# EAGLE design loramesh (EAGLE 9.6.2)
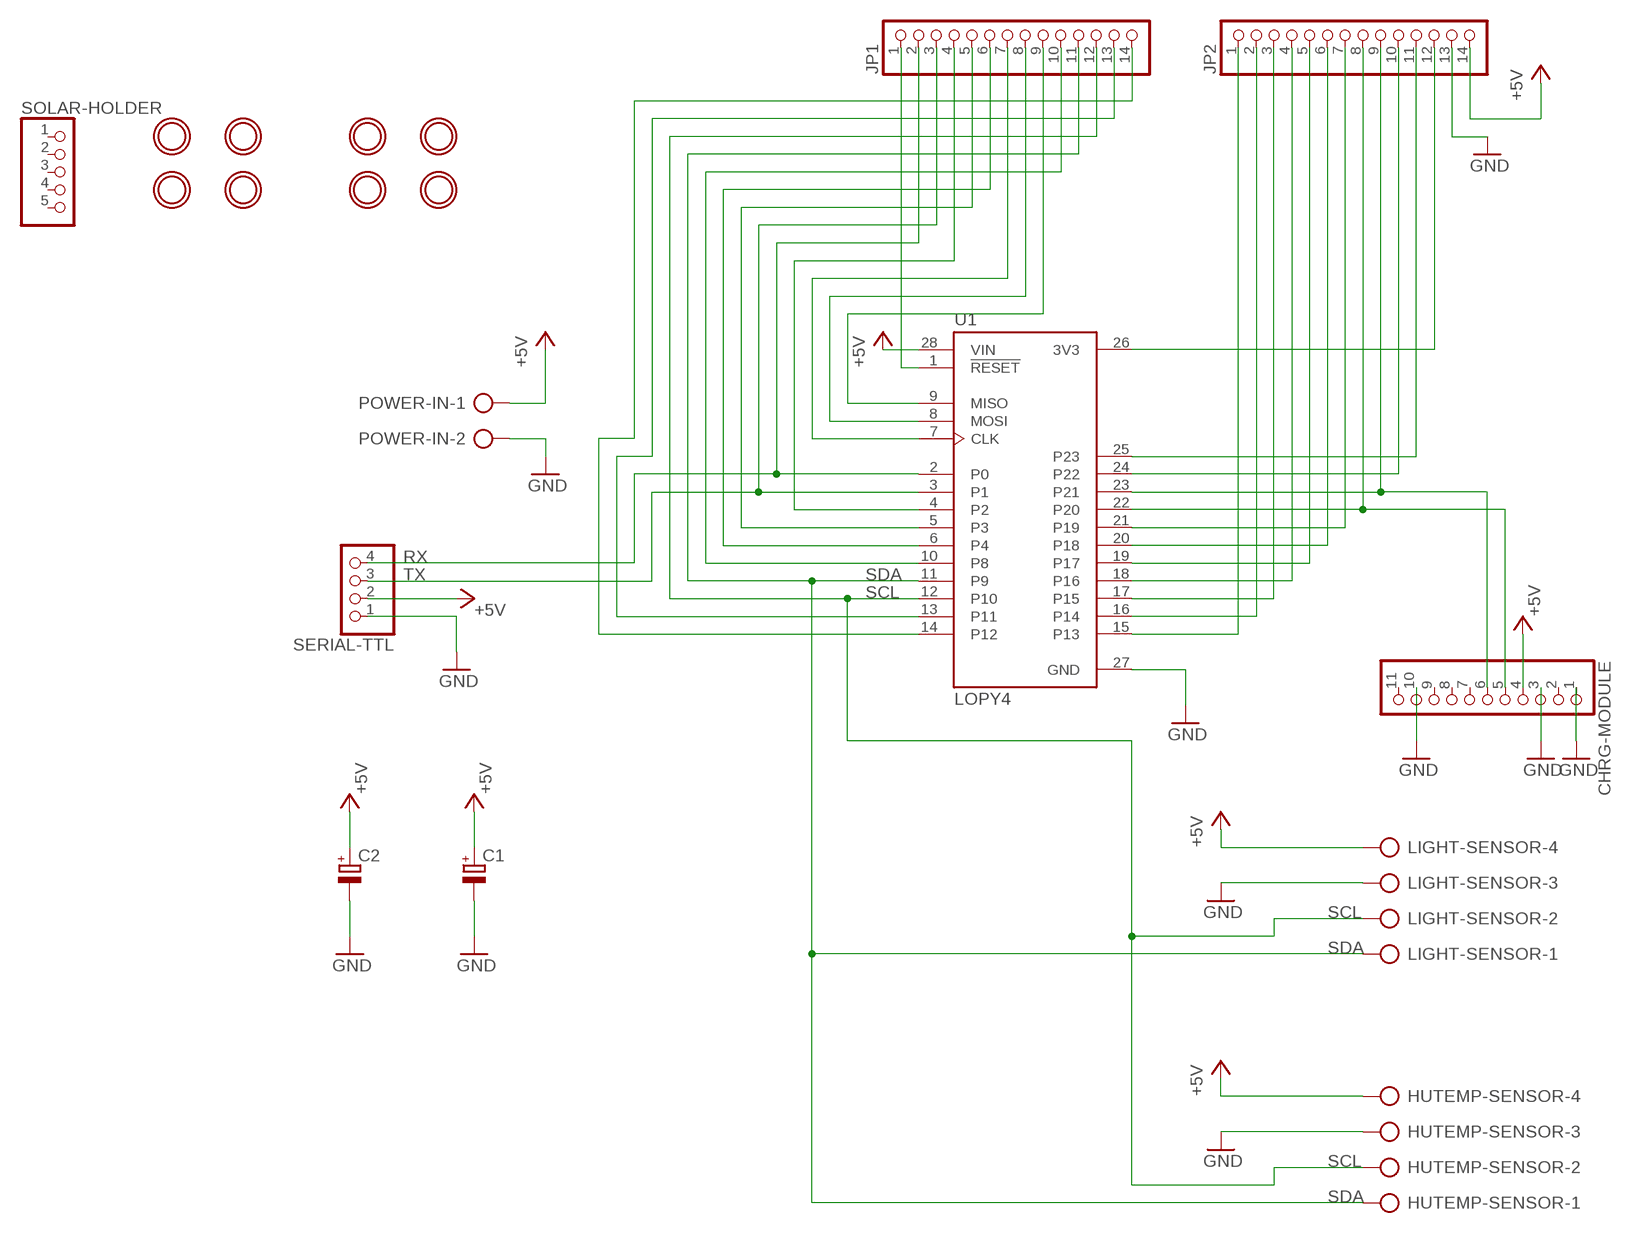
[diagram p0: schematic, sheet 1]

## Parts
C1  CPOL-EUE2.5-5  [E2,5-5]
C2  CPOL-EUE2.5-5  [E2,5-5]
CHRG-MODULE  HEADER-1X1176MIL  [1X11_ROUND_76]
HUTEMP-SENSOR  AK500/4  [AK500/4]
JP1  PINHD-1X14  [1X14]
JP2  PINHD-1X14  [1X14]
LIGHT-SENSOR  AK500/4  [AK500/4]
POWER-IN  AK500/2  [AK500/2]
SERIAL-TTL  PINHD-1X4  [1X04]
SOLAR-HOLDER  PINHD-1X5  [1X05]
U1  LOPY4  [MODULE_LOPY4]
U$1  MOUNTINGHOLE2.5  [MOUNTINGHOLE_2.5_PLATED]
U$2  MOUNTINGHOLE2.5  [MOUNTINGHOLE_2.5_PLATED]
U$3  MOUNTINGHOLE2.5  [MOUNTINGHOLE_2.5_PLATED]
U$4  MOUNTINGHOLE2.5  [MOUNTINGHOLE_2.5_PLATED]
U$26  MOUNTINGHOLE2.5  [MOUNTINGHOLE_2.5_PLATED]
U$27  MOUNTINGHOLE2.5  [MOUNTINGHOLE_2.5_PLATED]
U$28  MOUNTINGHOLE2.5  [MOUNTINGHOLE_2.5_PLATED]
U$29  MOUNTINGHOLE2.5  [MOUNTINGHOLE_2.5_PLATED]

## Nets
+5V: C1.+ C2.+ CHRG-MODULE.4 HUTEMP-SENSOR.4 JP2.14 LIGHT-SENSOR.4 POWER-IN.1 SERIAL-TTL.2 U1.28(VIN)
GND: C1.- C2.- CHRG-MODULE.1 CHRG-MODULE.3 CHRG-MODULE.10 HUTEMP-SENSOR.3 JP2.13 LIGHT-SENSOR.3 POWER-IN.2 SERIAL-TTL.1 U1.27(GND)
N$1: CHRG-MODULE.5 JP2.8 U1.22(P20)
N$2: CHRG-MODULE.6 JP2.9 U1.23(P21)
N$3: JP1.1 U1.1(!RESET)
N$4: JP1.14 U1.14(P12)
N$5: JP1.13 U1.13(P11)
N$6: JP1.4 U1.4(P2)
N$7: JP1.5 U1.5(P3)
N$8: JP1.6 U1.6(P4)
N$9: JP1.7 U1.7(CLK)
N$10: JP1.8 U1.8(MOSI)
N$11: JP1.9 U1.9(MISO)
N$12: JP1.10 U1.10(P8)
N$13: JP2.1 U1.15(P13)
N$14: JP2.2 U1.16(P14)
N$15: JP2.3 U1.17(P15)
N$16: JP2.4 U1.18(P16)
N$17: JP2.5 U1.19(P17)
N$18: JP2.6 U1.20(P18)
N$19: JP2.7 U1.21(P19)
N$22: JP2.10 U1.24(P22)
N$23: JP2.11 U1.25(P23)
N$24: JP2.12 U1.26(3V3)
RX: JP1.2 SERIAL-TTL.4 U1.2(P0)
SCL: HUTEMP-SENSOR.2 JP1.12 LIGHT-SENSOR.2 U1.12(P10)
SDA: HUTEMP-SENSOR.1 JP1.11 LIGHT-SENSOR.1 U1.11(P9)
TX: JP1.3 SERIAL-TTL.3 U1.3(P1)
Unconnected: CHRG-MODULE.2 CHRG-MODULE.7 CHRG-MODULE.8 CHRG-MODULE.9 CHRG-MODULE.11 SOLAR-HOLDER.1 SOLAR-HOLDER.2 SOLAR-HOLDER.3 SOLAR-HOLDER.4 SOLAR-HOLDER.5

## Library data of the parts
C1 C2 = rcl:CPOL-EU: POLARIZED CAPACITOR, European symbol; SPICEPREFIX: C
CHRG-MODULE = microbuilder:HEADER-1X11
HUTEMP-SENSOR LIGHT-SENSOR = con-ptr500:AK500/4: CONNECTOR; OC_FARNELL: unknown; OC_NEWARK: unknown
JP1 JP2 = pinhead:PINHD-1X14: PIN HEADER
POWER-IN = con-ptr500:AK500/2: CONNECTOR; OC_FARNELL: unknown; OC_NEWARK: unknown
SERIAL-TTL = pinhead:PINHD-1X4: PIN HEADER
SOLAR-HOLDER = pinhead:PINHD-1X5: PIN HEADER
U1 = LOPY4:LOPY4: ESP32, L04 - Transceiver; 802.11 b/g/n (Wi-Fi, WiFi, WLAN), Bluetooth Smart Ready 4.x Dual Mode, LoRa (LoRaWAN), Sigfox Evaluation Board Check availability <https://pricing.snapeda.com/parts/LOPY4/Pycom%20Ltd./view-part?ref=eda>; AVAILABILITY: In Stock; DESCRIPTION: - ESP32, L04 Transceiver; 802.11 b/g/n (Wi-Fi, WiFi, WLAN), Bluetooth® Smart Ready 4.x Dual Mode, LoRa® (LoRaWAN™), Sigfox 433MHz, 470MHz ~ 510MHz, 868MHz, 915MHz, 2.4GHz Evaluation Board; MF: Pycom Ltd.; MP: LOPY4; PACKAGE: None; PRICE: None; PURCHASE-URL: https://pricing.snapeda.com/search?q=LOPY4&ref=eda
U$1-U$4 U$26-U$29 = microbuilder:MOUNTINGHOLE: Mounting Hole For #2 screws (0.086"/2.18mm width, 0.094"/2.4mm hole) use 2.5mm; BOM: EXCLUDE

## Net classes
1 GND: width 1.27 mm, drill 0.406 mm, clearance 0.406 mm

## Board
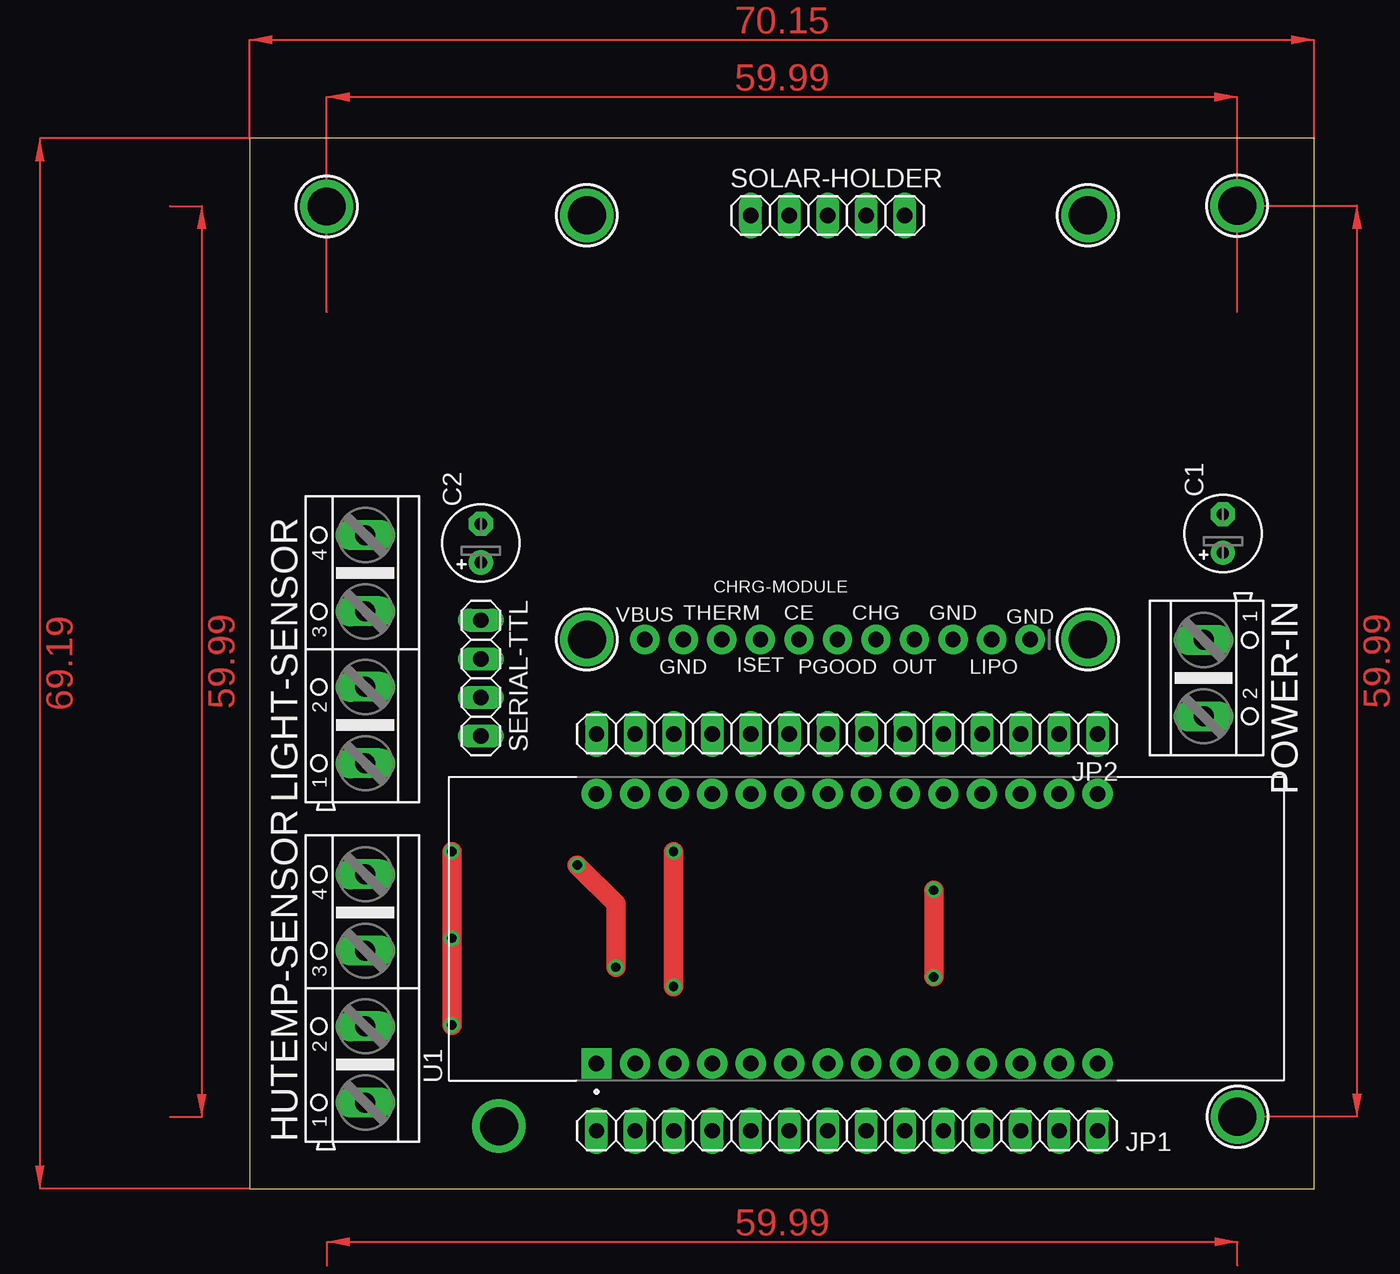
[diagram p1: board, top side]
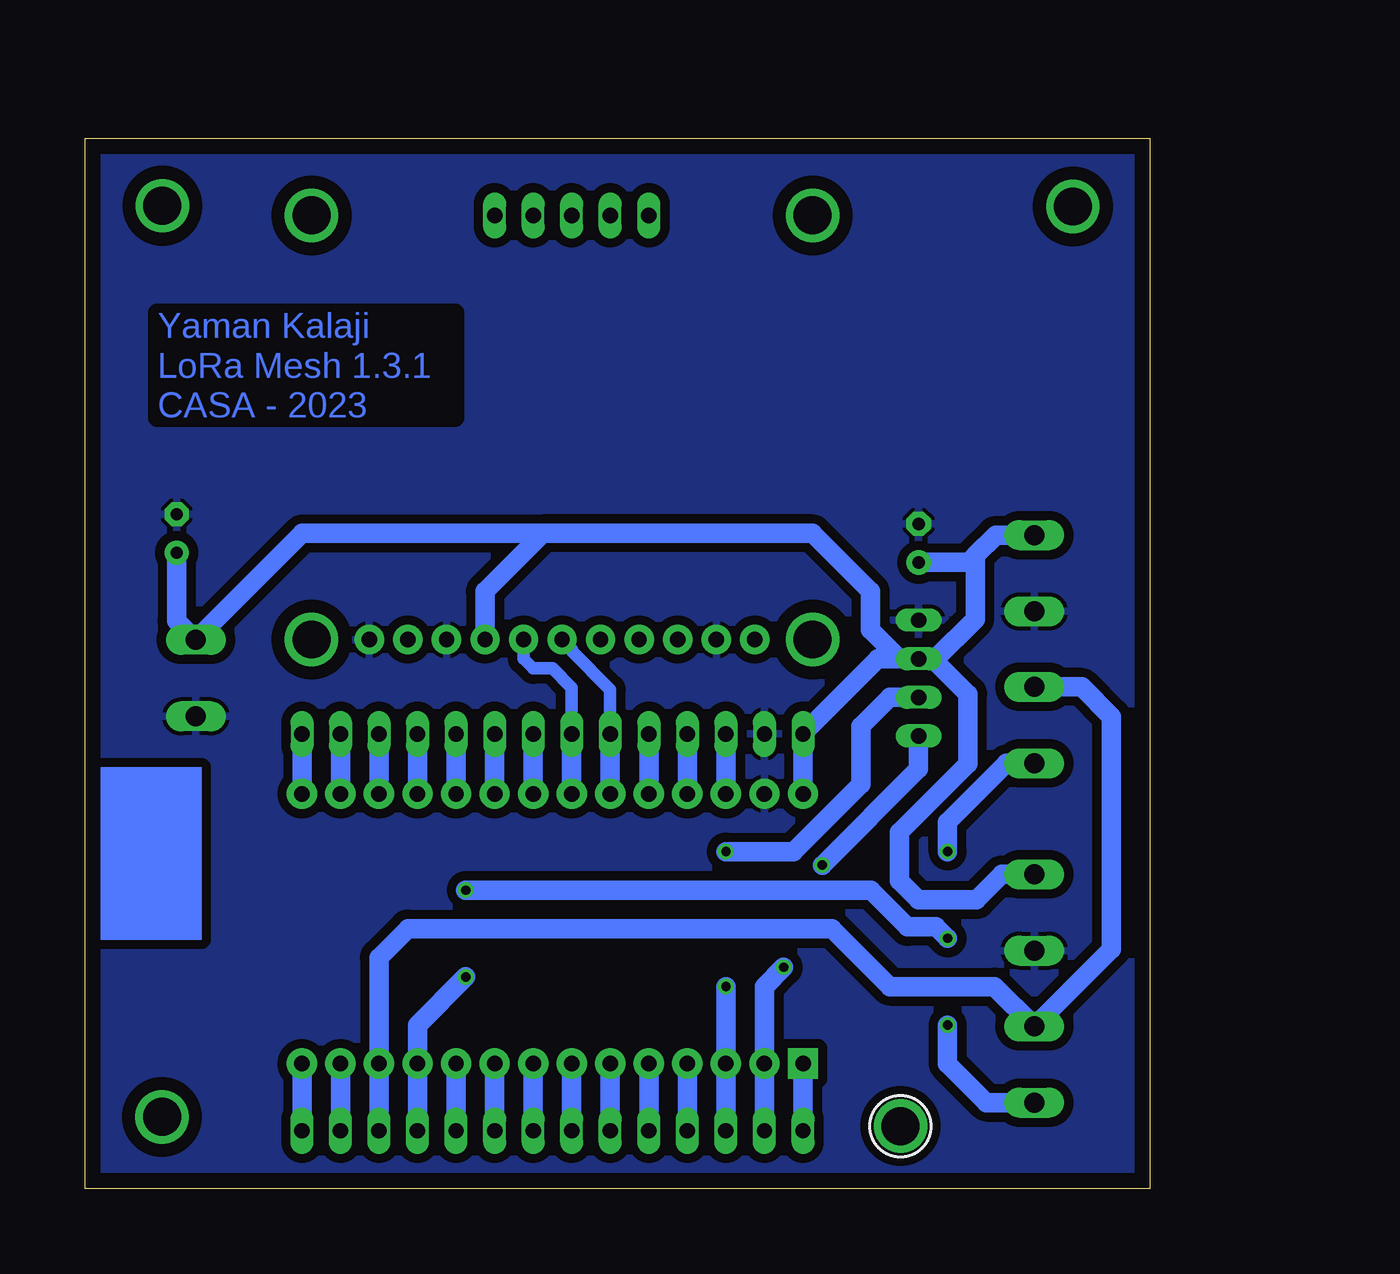
[diagram p2: board, bottom side, seen from below]

Size 70.16 x 69.2 mm. Coordinates in mm from the lower left corner, seen from the top.
Outline: 0,0 70.16,0 70.16,69.2 0,69.2 0,0
Copper layers (1*16): Top 0.035mm / dielectric 1.5mm / Bottom 0.035mm
Design rules "default2": minimum track width 24mil, minimum drill 24mil, track to track 20mil, track to pad 20mil, pad to pad 20mil, via to via 20mil, smd to smd 8mil, copper to edge 40mil, drill to drill 8mil, minimum pad ring 10mil, minimum via ring 8mil, stop-mask expansion 4mil, vias tented up to drill 0mil, thermal gap 10mil

### Footprints (pad centres in the part's own frame; a part is rotated, then mirrored left to right if it is on the bottom)
E2,5-5 = drill 0.813 pad 1.6: + -1.27,0 | drill 0.813 pad 1.6 octagon: - 1.27,0
1X11_ROUND_76 = drill 1 pad 1.93: 1 -12.7,0; 2 -10.16,0; 3 -7.62,0; 4 -5.08,0; 5 -2.54,0; 6 0,0; 7 2.54,0; 8 5.08,0; 9 7.62,0; 10 10.16,0; 11 12.7,0
AK500/4 = drill 1.321 long: 1 -7.518,0; 2 -2.489,0; 3 2.489,0; 4 7.518,0
1X14 = drill 1.016 long: 1 -16.51,0; 2 -13.97,0; 3 -11.43,0; 4 -8.89,0; 5 -6.35,0; 6 -3.81,0; 7 -1.27,0; 8 1.27,0; 9 3.81,0; 10 6.35,0; 11 8.89,0; 12 11.43,0; 13 13.97,0; 14 16.51,0
AK500/2 = drill 1.321 long: 1 -2.515,0; 2 2.515,0
1X04 = drill 1.016 long: 1 -3.81,0; 2 -1.27,0; 3 1.27,0; 4 3.81,0
1X05 = drill 1.016 long: 1 -5.08,0; 2 -2.54,0; 3 0,0; 4 2.54,0; 5 5.08,0
MODULE_LOPY4 = drill 1.02 pad 2 square: 1 -8.89,17.78 | drill 1.02 pad 2: 2 -8.89,15.24; 3 -8.89,12.7; 4 -8.89,10.16; 5 -8.89,7.62; 6 -8.89,5.08; 7 -8.89,2.54; 8 -8.89,0; 9 -8.89,-2.54; 10 -8.89,-5.08; 11 -8.89,-7.62; 12 -8.89,-10.16; 13 -8.89,-12.7; 14 -8.89,-15.24; 15 8.89,-15.24; 16 8.89,-12.7; 17 8.89,-10.16; 18 8.89,-7.62; 19 8.89,-5.08; 20 8.89,-2.54; 21 8.89,0; 22 8.89,2.54; 23 8.89,5.08; 24 8.89,7.62; 25 8.89,10.16; 26 8.89,12.7; 27 8.89,15.24; 28 8.89,17.78
MOUNTINGHOLE_2.5_PLATED = drill 2.5 pad 3.2: P$1 0,0

### Placement (x,y rotation side)
C1  64.14,43.18 90 top
C2  15.24,42.55 90 top
CHRG-MODULE  38.73,36.2 180 top
HUTEMP-SENSOR  7.62,13.21 90 top
JP1  39.37,3.84 0 top
JP2  39.37,29.97 180 top
LIGHT-SENSOR  7.62,35.56 90 top
POWER-IN  62.87,33.66 270 top
SERIAL-TTL  15.24,33.66 270 top
SOLAR-HOLDER  38.1,64.14 0 top
U1  40.64,17.15 90 top
U$1  5.08,64.72 0 top
U$2  65.07,64.77 0 top
U$3  16.43,4.14 0 bottom
U$4  65.1,4.75 0 top
U$26  22.23,36.2 0 top
U$27  22.23,64.14 0 top
U$28  55.24,64.14 0 top
U$29  55.24,36.2 0 top

### Tracks (layer width: path | path; a pad name or v marks a point on that pad's centre or on a via)
+5V
  Bottom 1.27: 11.51,41.73 11.51,37.54 14.12,34.92 SERIAL-TTL.2 | U1.28 JP2.14 17.91,34.92 SERIAL-TTL.2 | 40.01,43.18 22.23,43.18 18.41,39.37 18.41,36.83 16.51,34.92 SERIAL-TTL.2 | 40.01,43.18 43.81,39.37 CHRG-MODULE.4 | 40.01,43.18 55.85,43.18 POWER-IN.1 64.14,37.44 C1.+ | HUTEMP-SENSOR.4 9.75,20.73 11.43,19.05 15.24,19.05 16.51,20.32 16.51,23.49 11.99,28.02 11.99,32.59 14.32,34.92 SERIAL-TTL.2 | 11.51,41.73 10.16,43.08 LIGHT-SENSOR.4 | C2.+ 11.96,41.27 11.51,41.73
GND
  pour Bottom (isolate 0.61): 0,-4.42 0,69.22 122.86,69.22 122.86,-4.42
N$1
  Bottom 0.813: JP2.8 38.1,33.02 39.37,34.29 40.64,34.29 41.27,34.92 CHRG-MODULE.5
  Bottom 1.27: JP2.8 U1.22
N$2
  Bottom 0.813: CHRG-MODULE.6 38.08,35.53 38.08,35.42 35.56,32.9 JP2.9
  Bottom 1.27: JP2.9 U1.23
N$3
  Bottom 1.27: U1.1 JP1.1
N$4
  Bottom 1.27: U1.14 JP1.14
N$5
  Bottom 1.27: U1.13 JP1.13
N$6
  Bottom 1.27: U1.4 JP1.4
N$7
  Bottom 1.27: U1.5 JP1.5
N$8
  Bottom 1.27: U1.6 JP1.6
N$9
  Bottom 1.27: U1.7 JP1.7
N$10
  Bottom 1.27: U1.8 JP1.8
N$11
  Bottom 1.27: U1.9 JP1.9
N$12
  Bottom 1.27: U1.10 JP1.10
N$13
  Bottom 1.27: JP2.1 U1.15
N$14
  Bottom 1.27: JP2.2 U1.16
N$15
  Bottom 1.27: JP2.3 U1.17
N$16
  Bottom 1.27: JP2.4 U1.18
N$17
  Bottom 1.27: JP2.5 U1.19
N$18
  Bottom 1.27: JP2.6 U1.20
N$19
  Bottom 1.27: JP2.7 U1.21
N$22
  Bottom 1.27: JP2.10 U1.24
N$23
  Bottom 1.27: JP2.11 U1.25
N$24
  Bottom 1.27: JP2.12 U1.26
RX  (via drill 0.61)
  Top 1.27: v21.59,21.34 24.13,18.8 v24.13,14.6
  Bottom 0.813: v21.59,21.34 21.58,21.34
  Bottom 1.27: JP1.2 U1.2 25.4,13.33 v24.13,14.6 | v21.59,21.34 15.24,27.69 SERIAL-TTL.4
SCL
  Bottom 1.27: JP1.12 U1.12 50.8,15.24 48.9,17.15 20.95,17.15 17.14,13.33 10.24,13.33 HUTEMP-SENSOR.2 2.54,15.8 2.54,31.11 4.5,33.07 LIGHT-SENSOR.2
SDA  (via drill 0.61)
  Top 1.27: v13.34,22.23 v13.34,16.51 v13.34,10.79 | v45.09,19.69 v45.09,13.97
  Bottom 1.27: JP1.11 U1.11 48.26,10.79 v45.09,13.97 | v13.34,22.23 13.34,24.16 9.45,28.04 LIGHT-SENSOR.1 | v13.34,16.51 14.1,17.27 15.98,17.27 18.39,19.69 v45.09,19.69 | v13.34,10.79 13.34,8.26 10.77,5.69 HUTEMP-SENSOR.1
TX  (via drill 0.61)
  Top 1.27: v27.94,13.33 v27.94,22.23
  Bottom 1.27: JP1.3 U1.3 v27.94,13.33 | v27.94,22.23 23.5,22.23 19.05,26.67 19.05,30.48 17.14,32.38 SERIAL-TTL.3
(copper drawn outside any net)
  shapes: Bottom area x1, Top area x6

### Text on the board
Bottom: Yaman Kalaji / LoRa Mesh 1.3.1 / CASA - 2023
tPlace: VBUS | THERM | CE | CHG | GND | GND | GND | ISET | PGOOD | OUT | LIPO